# Altium project MB1361.PrjPcb (part 3 of 3)

## Sheet USB_Type_C.SchDoc: USB_Type_C
size A4; Date: Not used; ApprovedBy: Not used; CheckedBy: Not used; Author: Not used; CompanyName: STMicroelectronics; DrawnBy: Not used; Engineer: Not used; Organization: Not used; Address1: Not used; Address2: Not used; Address3: Not used; Address4: Not used; DocumentNumber: 7; Revision: Not used; SheetNumber: 7; SheetTotal: 9; CurrentTime: Not used; CurrentDate: Not used; Time: Not used; DocumentFullPathAndName: Not used; DocumentName: Not used; ModifiedDate: Not used; ImagePath: Not used; ProjectName: Not used; Application_BuildNumber: Not used
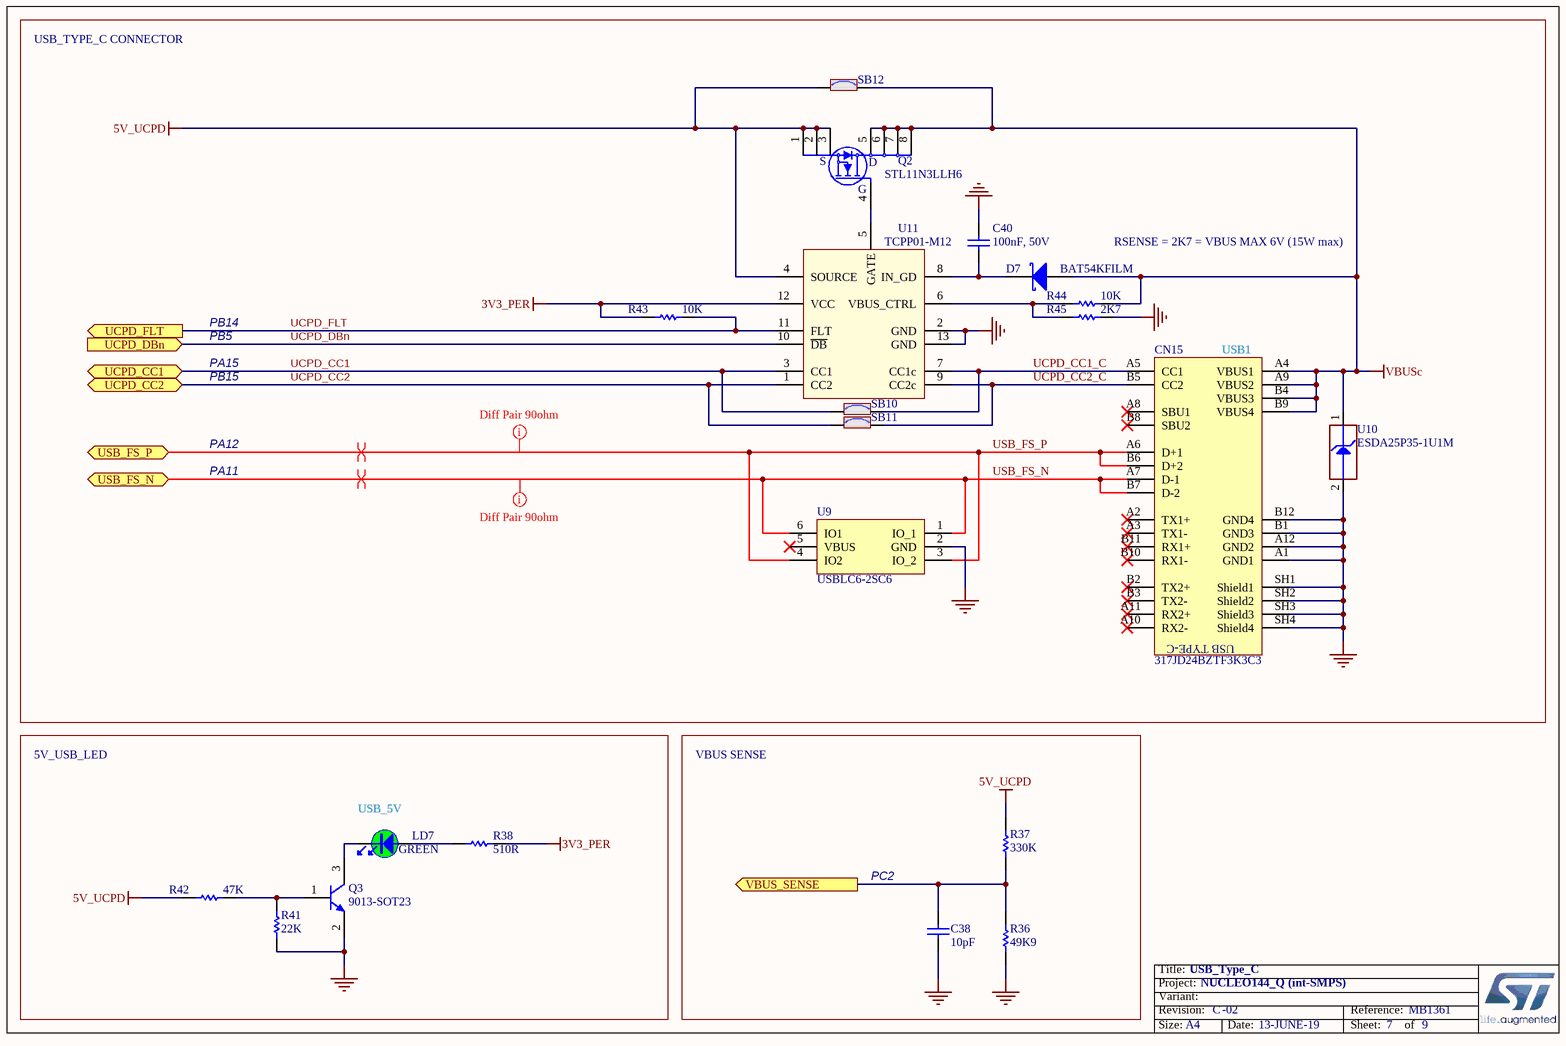
[diagram p7: USB_Type_C.SchDoc]

### Parts
C38  value 10pF  [C0603]
C40  value 100nF, 50V  [C0603]  (hidden comment: Capacitor)
CN15  value 317JD24BZTF3K3C3  [CON_USB-TYPEC_COXOC_317JD24BZTF3K3C3]  (hidden comment: USB_TYPE_C_Receptacle_317JD24BZTF3K3C3)
D7  value BAT54KFILM  [DIO_SOD523_1A_2K]  (hidden comment: SCHOTTKY_1A_2K)
LD7  value GREEN  [LED_0603_GREEN]
Q2  STL11N3LLH6  [MOS_POWERFLAT_3P3X3P3_P065]
Q3  value 9013-SOT23  [NPN_SOT23]
R36  value 49K9  [R0603]
R37  value 330K  [R0603]
R38  value 510R  [R0603]
R41  value 22K  [R0603]
R42  value 47K  [R0603]
R43  value 10K  [R0603]  (hidden comment: Resistor)
R44  value 10K  [R0603]  (hidden comment: Resistor)
R45  value 2K7  [R0603]  (hidden comment: Resistor)
SB10  (no value)  [SOLDER-BRIDGE_R0603-0R]
SB11  (no value)  [SOLDER-BRIDGE_R0603-0R]
SB12  (no value)  [SOLDER-BRIDGE_R0603-0R]
U9  USBLC6-2SC6  [ESD_SOT23-6L]
U10  value ESDA25P35-1U1M  [ESD_QFN1610_2N_1K_2A]  (hidden comment: ESD-TRANSIL)
U11  TCPP01-M12  [ICC_QFN12L-EPAD_3X3_P050]

### Ports
UCPD_CC1 (bidir), UCPD_CC2 (bidir), UCPD_DBn, UCPD_FLT, USB_FS_N (bidir), USB_FS_P (bidir), VBUS_SENSE

### Nets
3V3_PER: R38.1 R43.2 U11.12(VCC)
5V_UCPD: Q2.1(S) Q2.2(S) Q2.3(S) R37.2 R42.1 SB12.1 U11.4(SOURCE)
GND: C38.1 C40.1 CN15.A1(GND1) CN15.A12(GND2) CN15.B1(GND3) CN15.B12(GND4) CN15.SH1(Shield1) CN15.SH2(Shield2) CN15.SH3(Shield3) CN15.SH4(Shield4) Q3.2(E) R36.1 R41.1 R45.1 U9.2(GND) U10.2(GND) U11.2(GND) U11.13(GND)
VBUSc: CN15.A4(VBUS1) CN15.A9(VBUS2) CN15.B4(VBUS3) CN15.B9(VBUS4) D7.1(A) Q2.5(D) Q2.6(D) Q2.7(D) Q2.8(D) R44.2 SB12.2 U10.1(IO1)
UCPD_CC1: SB10.1 U11.3(CC1) ; port UCPD_CC1  [project net PA15]
UCPD_CC1_C: CN15.A5(CC1) SB10.2 U11.7(CC1c)
UCPD_CC2: SB11.1 U11.1(CC2) ; port UCPD_CC2  [project net PB15]
UCPD_CC2_C: CN15.B5(CC2) SB11.2 U11.9(CC2c)
UCPD_DBn: U11.10(~{DB}) ; port UCPD_DBn  [project net PB5]
UCPD_FLT: R43.1 U11.11(FLT) ; port UCPD_FLT  [project net PB14]
USB_FS_N: CN15.A7(D-1) CN15.B7(D-2) U9.1(IO_1) U9.6(IO1) ; port USB_FS_N
USB_FS_P: CN15.A6(D+1) CN15.B6(D+2) U9.3(IO_2) U9.4(IO2) ; port USB_FS_P
VBUS_SENSE: C38.2 R36.2 R37.1 ; port VBUS_SENSE
NetC40_2: C40.2 D7.2(K) U11.8(IN_GD)
NetLD7_1: LD7.1 R38.2
NetLD7_2: LD7.2 Q3.3(C)
NetQ2_4: Q2.4(G) U11.5(GATE)
NetQ3_1: Q3.1(B) R41.2 R42.2
NetR44_1: R44.1 R45.2 U11.6(VBUS_CTRL)

Not connected (* = marked no-connect by the designer): CN15 A2(TX1+)* A3(TX1-)* A8(SBU1)* A10(RX2-)* A11(RX2+)* B2(TX2+)* B3(TX2-)* B8(SBU2)* B10(RX1-)* B11(RX1+)*; U9 5(VBUS)*

### Layout directives
mark named Diff Pair 90ohm: USB_FS_N, USB_FS_P
differential pair: USB_FS_N, USB_FS_P

### Notes on the sheet
- USB_TYPE_C CONNECTOR
- RSENSE = 2K7 = VBUS MAX 6V (15W max)
- PA15
- PB15
- PB14
- PB5
- (near CN15) USB1
- PA12
- PA11
- 5V_USB_LED
- VBUS SENSE
- (near LD7) USB_5V
- PC2
- Title:
- Project:
- Size:
- Revision:
- Variant:
- A4
- -
- Date:
- Reference:
- Sheet:
- of
- (in symbol MCD-01108) USB TYPE-C

### Library data of the parts
C38 = MCD-00637: Capacitor, MLCC, 10pF, 50V, NPO, 5%, 0603, T=0,8mm; Manufacturer_Part_Number: CC0603JRNPO9BN100; Manufacturer: YAGEO; Provided_By: subcon; Initial_Board_Reference: MB1319; Internal_Part_Number: MCD-00637; Status: Released; Part_Type: Capacitor; Package: C0603; ComponentLink1Description: Datasheet; ComponentLink1URL: http://tunmcdsvn.tun.st.com/Component_Datasheet_Library/Trunk/Capacitors/Yageo_Capacitor_NP0_16V-to-50V; ECCN_US: n/a; ECCN_EU: n/a
C40 = MCD-01099: Capacitor,100nF,50V,X7R,10%,0603; Manufacturer_Part_Number: CC0603KRX7R9BB104; Manufacturer: YAGEO; Provided_By: SUBCO; Internal_Part_Number: MCD-01099; Status: Released; Part_Type: Capacitor; Package: C0603; ComponentLink1Description: Datasheet; ComponentLink1URL: http://tunmcdsvn.tun.st.com/Component_Datasheet_Library/Trunk/Capacitors/Yageo_Multilayer_Capacitor_X7R_series_100pF_to_22uF/Yageo_Mutilayer_Capacitor_X7R_100pF_to_22uF.pdf; ECCN_US: N/A; ECCN_EU: N/A
CN15 = MCD-01108: USB tyce C certified receptacle for 1.6mm pcb height; Part_Type: Connector; Manufacturer: CHANT SINCERE (COXOC); Provided_By: SUBCO; Internal_Part_Number: MCD-01108; Status: Released; Manufacturer_Part_Number: 317JD24BZTF3K3C3; ComponentLink1Description: Datasheet; ComponentLink1URL: http://tunmcdsvn.tun.st.com/Component_Datasheet_Library/Trunk/Connectors/Chant%20sincere_usb%20type%20C%20connector%20317JD24BZTF3K3C3; ECCN_US: n/a; ECCN_EU: n/a
D7 = MCD-01677: Small signal Schottky diodes; Part_Type: Diode; Manufacturer: STMICROELECTRONICS; ECCN_US: EAR99; ECCN_EU: NEC; Provided_By: SUBCO; Internal_Part_Number: MCD-01677; Status: Checked; Manufacturer_Part_Number: BAT54KFILM; Package: SOD-523; ComponentLink1Description: Datasheet; ComponentLink1URL: http://tunmcdsvn.tun.st.com/Component_Datasheet_Library/Trunk/Diodes/STM_SCHOTTKY_DOUBLE_BAT54SWFILM/STM_SCHOTTKY_DOUBLE_BAT54SWFILM.pdf
LD7 = MCD-00050: LED, Green, 0603; Part_Type: Display; Manufacturer_Part_Number: 19-213SYGC/S530-E2/TR8; Manufacturer: EVERLIGHT; ECCN_US: EAR99; ECCN_EU: NEC; Provided_By: Subcon; Initial_Board_Reference: MB1274; Internal_Part_Number: MCD-00050; Status: Released; ComponentLink1Description: Datasheet; Package: LED 0603; ComponentLink1URL: http://tunmcdsvn.tun.st.com/Component_Datasheet_Library/Trunk/Display/Everlight_SMD-LED-GREEN_19-213SYGC-S530-XX-TR8-v3.doc
Q2 = MCD-01810: N-channel 30 V, 6 mΩ typ, 11 A STripFET™ H6, Power MOSFET in a PowerFLAT™ 3.3x3.3 package; Part_Type: IC; Manufacturer: STMICROELECTRONICS; ECCN_US: EAR99; ECCN_EU: NEC; Provided_By: SUBCO with ST control; Internal_Part_Number: MCD-01810; Value: STL11N3LLH6; Status: Checked; Manufacturer_Part_Number: STL11N3LLH6; Package: PowerFLAT 3.3x3.3; ComponentLink1Description: Datasheet; ComponentLink1URL: http://tunmcdsvn.tun.st.com/Component_Datasheet_Library/Trunk/IC/STM_POWER_MOSFET_STL11N3LLH6
Q3 = MCD-00073: NPN Bipolar Transistor; Part_Type: IC; Manufacturer_Part_Number: BSR14; Manufacturer: NXP; ECCN_US: EAR99; ECCN_EU: NEC; Provided_By: Subcon; Initial_Board_Reference: MB1274; Revision: *; Internal_Part_Number: MCD-00073; Status: Released; ComponentLink1Description: Datasheet; ComponentLink1URL: http://tunmcdsvn.tun.st.com/Component_Datasheet_Library/Trunk/IC/NXP_Transistor_BSR14
R36 = MCD-01171: Resistor,49K9,0603,1%; Manufacturer_Part_Number: RC0603FR-0749K9L; Manufacturer: YAGEO; Provided_By: Subcon; Initial_Board_Reference: MB1397; Internal_Part_Number: MCD-01171; Status: Released; Part_Type: Resistor; Package: R0603; ComponentLink1Description: Datasheet; ComponentLink1URL: http://tunmcdsvn.tun.st.com/Component_Datasheet_Library/Trunk/Resistors/Yageo_Resistor_RC0603-series/; ECCN_US: n/a; ECCN_EU: n/a
R37 = MCD-00458: Resistor,330K,0603,1%,1/10W; Manufacturer_Part_Number: RC0603FR-07330KL; Manufacturer: YAGEO; Provided_By: Subcon; Internal_Part_Number: MCD-00458; Status: Released; Part_Type: Resistor; Package: R0603; ComponentLink1Description: Datasheet; ComponentLink1URL: http://tunmcdsvn.tun.st.com/Component_Datasheet_Library/Trunk/Resistors/Yageo_Resistor_RC0603-series; ECCN_US: n/a; ECCN_EU: n/a
R38 = MCD-00225: Resistor,510R,0603,1%,1/10W; Manufacturer_Part_Number: RC0603FR-07510RL; Manufacturer: YAGEO; Provided_By: Subcon; Initial_Board_Reference: MB1319; Internal_Part_Number: MCD-00225; Status: Released; Part_Type: Resistor; ComponentLink1Description: Datasheet; ECCN_US: n/a; ECCN_EU: n/a; Package: R0603; ComponentLink1URL: http://tunmcdsvn.tun.st.com/Component_Datasheet_Library/Trunk/Resistors/Yageo_Resistor_RC0603-series
R41 = MCD-00430: Resistor,22K,0603,1%,1/10W; Manufacturer_Part_Number: RC0603FR-0722KL; Manufacturer: YAGEO; Provided_By: Subcon; Internal_Part_Number: MCD-00430; Status: Released; Part_Type: Resistor; ComponentLink1Description: Datasheet; ECCN_US: n/a; ECCN_EU: n/a; Package: R0603; ComponentLink1URL: http://tunmcdsvn.tun.st.com/Component_Datasheet_Library/Trunk/Resistors/Yageo_Resistor_RC0603-series
R42 = MCD-00222: Resistor,47K,0603,1%,1/10W; Manufacturer_Part_Number: RC0603FR-0747KL; Manufacturer: YAGEO; Provided_By: Subcon; Initial_Board_Reference: MB1319; Internal_Part_Number: MCD-00222; Status: Released; Part_Type: Resistor; ComponentLink1Description: Datasheet; ECCN_US: n/a; ECCN_EU: n/a; Package: R0603; ComponentLink1URL: http://tunmcdsvn.tun.st.com/Component_Datasheet_Library/Trunk/Resistors/Yageo_Resistor_RC0603-series
R43 R44 = MCD-00220: Resistor,10K,0603,1%,1/10W; Manufacturer_Part_Number: RC0603FR-0710KL; Manufacturer: YAGEO; ECCN_US: EAR99; ECCN_EU: NEC; Provided_By: SUBCO; Internal_Part_Number: MCD-00220; Status: Released; Part_Type: Resistor; Package: R0603; ComponentLink1Description: Datasheet; ComponentLink1URL: http://tunmcdsvn.tun.st.com/Component_Datasheet_Library/Trunk/Resistors/Yageo_Resistor_RC0603-series
R45 = MCD-00218: Resistor,2K7,0603,1%,1/10W; Manufacturer_Part_Number: RC0603FR-072K7L; Manufacturer: YAGEO; BMS_Part_Number: 9129767; ECCN_US: EAR99; ECCN_EU: NEC; Provided_By: SUBCO; Internal_Part_Number: MCD-00218; Status: Released; Part_Type: Resistor; Package: R0603; ComponentLink1Description: Datasheet; ComponentLink1URL: http://tunmcdsvn.tun.st.com/Component_Datasheet_Library/Trunk/Resistors/Yageo_Resistor_RC0603-series
SB10-SB12 = MCD-00071: as SB111-SB113 on sheet ARDUINO_extension_connectors; Internal_Part_Number: MCD-00071; Status: Released; ECCN_US: n/a; ECCN_EU: n/a; ComponentLink1Description: Datasheet
U9 = MCD-00163: Very low capacitance ESD protection; Part_Type: IC; Manufacturer: STMICROELECTRONICS; BMS_Part_Number: 9151075; ECCN_US: EAR99; ECCN_EU: NEC; Provided_By: SUBCO with ST control; Internal_Part_Number: MCD-00163; Value: USBLC6-2SC6; Status: Released; Manufacturer_Part_Number: USBLC6-2SC6; ComponentLink1Description: Datasheet; ComponentLink1URL: http://tunmcdsvn.tun.st.com/Component_Datasheet_Library/Trunk/Diodes/STM_ESD_USBLC6-2
U10 = MCD-01207: High power Transient voltage suppressor:25V/35A EOS and ESD transients protection.; Part_Type: Diode; Manufacturer: STMICROELECTRONICS; BMS_Part_Number: 9179045; ECCN_US: EAR99; ECCN_EU: NEC; Provided_By: SUBCO with ST control; Internal_Part_Number: MCD-01207; Status: Checked; Manufacturer_Part_Number: ESDA25P35-1U1M; Package: QFN1610; ComponentLink1Description: Datasheet; ComponentLink1URL: http://tunmcdsvn.tun.st.com/Component_Datasheet_Library/Trunk/Diodes/STM_ESD_ESDA25P35-1U1M
U11 = MCD-01809: USB Type-C Port Protection for USB Power Delivery, PPS compliant; Part_Type: IC; Manufacturer: STMICROELECTRONICS; ECCN_US: EAR99; ECCN_EU: NEC; Provided_By: SUBCO with ST control; Internal_Part_Number: MCD-01809; Value: TCPP01-M12; Status: Checked; Manufacturer_Part_Number: TCPP01-M12; Package: QFN-12L; ComponentLink1Description: Datasheet; ComponentLink1URL: http://tunmcdsvn.tun.st.com/Component_Datasheet_Library/Trunk/IC/STM_UCPD_Protection_TCPP01-M12

## Sheet POWER_BOARD.SchDoc: POWER_BOARD
size A4; Date: Not used; ApprovedBy: Not used; CheckedBy: Not used; Author: Not used; CompanyName: STMicroelectronics; DrawnBy: Not used; Engineer: Not used; Organization: Not used; Address1: Not used; Address2: Not used; Address3: Not used; Address4: Not used; DocumentNumber: 6; Revision: Not used; SheetNumber: 6; SheetTotal: 9; CurrentTime: Not used; CurrentDate: Not used; Time: Not used; DocumentFullPathAndName: Not used; DocumentName: Not used; ModifiedDate: Not used; ImagePath: Not used; ProjectName: Not used; Application_BuildNumber: Not used
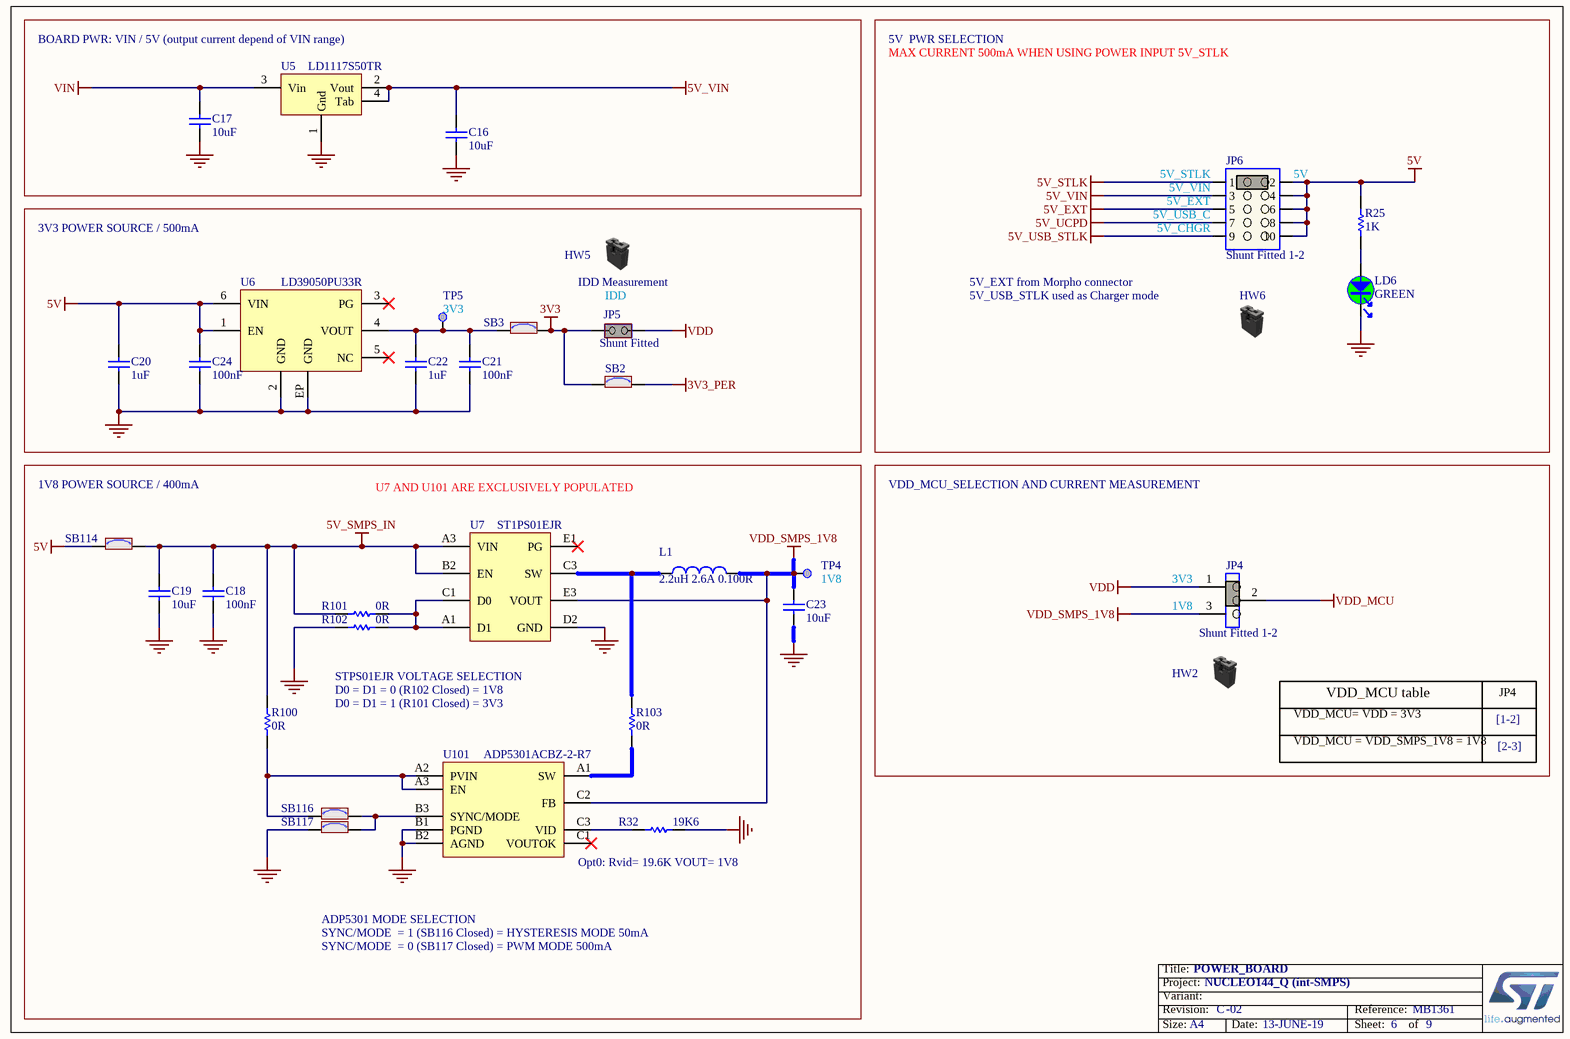
[diagram p8: POWER_BOARD.SchDoc]

### Parts
C16  value 10uF  [C0805]
C17  value 10uF  [C0805]
C18  value 100nF  [C0603]
C19  value 10uF  [C0603]
C20  value 1uF  [C0603]  (hidden comment: Capacitor)
C21  value 100nF  [C0603]
C22  value 1uF  [C0603]  (hidden comment: Capacitor)
C23  value 10uF  [C0603]
C24  value 100nF  [C0603]
HW2  (no value)  (mechanical)
HW5  (no value)  (mechanical)
HW6  (no value)  (mechanical)
JP4  value Shunt Fitted 1-2  [CON_SAMTEC_TSW-103-07-F-S]
JP5  value Shunt Fitted  [CON_SAMTEC_TSW-102-07-G-S]
JP6  value Shunt Fitted 1-2  [CON_SAMTEC_TSW-105-07-X-D]
L1  value 2.2uH 2.6A 0.100R  [IND_TDK_VLS252010HBX-1]
LD6  value GREEN  [LED_0603_GREEN]
R25  value 1K  [R0603]
R32  value 19K6  [R0603]
R100  value 0R  [R0603]
R101  value 0R  [R0603]
R102  value 0R  [R0603]
R103  value 0R  [R0603]
SB2  (no value)  [SOLDER-BRIDGE_R0603-0R]
SB3  (no value)  [SOLDER-BRIDGE_R0603-0R]
SB114  (no value)  [SOLDER-BRIDGE_R0603-0R]
SB116  (no value)  [SOLDER-BRIDGE_R0603-0R]
SB117  (no value)  [SOLDER-BRIDGE_R0603-0R]
TP4  (no value)  [TP_SMD_1MM]  (no BOM)
TP5  (no value)  [TP_SMD_1MM]  (no BOM)
U5  value LD1117S50TR  [REG_SOT223-TAB]
U6  value LD39050PU33R  [ICC_DFN6-EPAD_3X3_P095]
U7  value ST1PS01EJR  [ICC_FLIP-CHIP-BGA8_1P11X1P41_P040]
U101  value ADP5301ACBZ-2-R7  [ICC_WLCSP9_1P65X1P87_P050]

### Blocks framed on the sheet
BOARD PWR: VIN / 5V (output current depend of VIN range): C16 C17 U5
VDD_MCU table: HW2 JP4

### Nets
3V3: JP5.1(COMMON) SB2.1 SB3.2
3V3_PER: SB2.2
5V: C20.2 C24.2 JP6.2 JP6.4 JP6.6 JP6.8 JP6.10 R25.2 SB114.1 U6.1(EN) U6.6(VIN)
5V_EXT: JP6.5
5V_SMPS_IN: C18.2 C19.2 R100.1 R101.2 SB114.2 U7.A3(VIN) U7.B2(EN)
5V_STLK: JP6.1
5V_UCPD: JP6.7
5V_USB_STLK: JP6.9
5V_VIN: C16.2 JP6.3 U5.2(Vout) U5.4(Tab)
GND: C16.1 C17.1 C18.1 C19.1 C20.1 C21.1 C22.1 C23.1 C24.1 LD6.2 R32.2 R102.2 SB117.1 U5.1(Gnd) U6.2(GND) U6.EP(GND) U7.D2(GND) U101.B1(PGND) U101.B2(AGND)
VDD: JP4.1 JP5.2(NO)
VDD_MCU: JP4.2
VDD_SMPS_1V8: C23.2 JP4.3 L1.2 TP4.1 U7.E3(VOUT) U101.C2(FB)
VIN: C17.2 U5.3(Vin)
NetC21_2: C21.2 C22.2 SB3.1 TP5.1 U6.4(VOUT)
NetL1_1: L1.1 R103.1 U7.C3(SW)
NetLD6_1: LD6.1 R25.1
NetR32_1: R32.1 U101.C3(VID)
NetR100_2: R100.2 SB116.1 U101.A2(PVIN) U101.A3(EN)
NetR101_1: R101.1 R102.1 U7.A1(D1) U7.C1(D0)
NetR103_2: R103.2 U101.A1(SW)
NetSB116_2: SB116.2 SB117.2 U101.B3(SYNC/MODE)

Not connected (* = marked no-connect by the designer): U6 3(PG)* 5(NC)*; U7 E1(PG)*; U101 C1(VOUTOK)*

### Notes on the sheet
- 5V  PWR SELECTION
- MAX CURRENT 500mA WHEN USING POWER INPUT 5V_STLK
- (near JP6) 5V_STLK
- (near JP6) 5V
- 3V3 POWER SOURCE / 500mA
- (near JP6) 5V_CHGR
- (near JP6) 5V_VIN
- (near JP6) 5V_EXT
- (near JP6) 5V_USB_C
- (near TP5) 3V3
- IDD Measurement
- (near JP5) IDD
- 5V_EXT from Morpho connector
- 5V_USB_STLK used as Charger mode
- 1V8 POWER SOURCE / 400mA
- U7 AND U101 ARE EXCLUSIVELY POPULATED
- VDD_MCU_SELECTION AND CURRENT MEASUREMENT
- (near TP4) 1V8
- (near JP4) 3V3
- 1V8
- STPS01EJR VOLTAGE SELECTION
  D0 = D1 = 0 (R102 Closed) = 1V8
  D0 = D1 = 1 (R101 Closed) = 3V3
- VDD_MCU= VDD = 3V3
- [1-2]
- JP4
- VDD_MCU = VDD_SMPS_1V8 = 1V8
- [2-3]
- Opt0: Rvid= 19.6K VOUT= 1V8
- ADP5301 MODE SELECTION
  SYNC/MODE  = 1 (SB116 Closed) = HYSTERESIS MODE 50mA
  SYNC/MODE  = 0 (SB117 Closed) = PWM MODE 500mA
- Title:
- Project:
- Size:
- Revision:
- Variant:
- A4
- -
- Date:
- Reference:
- Sheet:
- of

### Library data of the parts
C16 C17 = MCD-00014: Capacitor, MLCC, 10uF, 25V, X5R, 10%, 0805, T=0,85mm; Manufacturer_Part_Number: CC0805KRX5R8BB106; Manufacturer: YAGEO; Provided_By: Subcon; Initial_Board_Reference: MB1274; Internal_Part_Number: MCD-00014; ECCN_US: n/a; ECCN_EU: n/a; ComponentLink1Description: Datasheet; Status: Released; Part_Type: Capacitor; Package: C0805; ComponentLink1URL: http://tunmcdsvn.tun.st.com/Component_Datasheet_Library/Trunk/Capacitors/Yageo_Multilayer_capacitor_X5R_series_100pF_to_100uF
C18 C21 C24 = MCD-00211: Capacitor, MLCC, 100nF, 16V, X7R, 10%, 0603, T=0,8mm; Manufacturer_Part_Number: CC0603KRX7R7BB104; Manufacturer: YAGEO; Provided_By: Subcon; Initial_Board_Reference: MB1319; Internal_Part_Number: MCD-00211; ECCN_US: n/a; ECCN_EU: n/a; ComponentLink1Description: Datasheet; Status: Released; Part_Type: Capacitor; Package: C0603; ComponentLink1URL: http://tunmcdsvn.tun.st.com/Component_Datasheet_Library/Trunk/Capacitors/Yageo_Multilayer_Capacitor_X7R_series_100pF_to_22uF
C19 C23 = MCD-00243: Capacitor, MLCC, 10uF, 6V3, X5R, 10%, 0603, T=0,8mm; Manufacturer_Part_Number: CC0603KRX5R5BB106; Manufacturer: YAGEO; Provided_By: Subcon; Initial_Board_Reference: MB1319; Internal_Part_Number: MCD-00243; ECCN_US: n/a; ECCN_EU: n/a; ComponentLink1Description: Datasheet; Status: Released; Part_Type: Capacitor; Package: C0603; ComponentLink1URL: http://tunmcdsvn.tun.st.com/Component_Datasheet_Library/Trunk/Capacitors/Yageo_Multilayer_capacitor_X5R_series_100pF_to_100uF
C20 C22 = MCD-00010: Capacitor, MLCC, 1uF, 16V, X5R, 10%, 0603, T=0,8mm; Manufacturer_Part_Number: CC0603KRX5R7BB105; Manufacturer: YAGEO; Provided_By: SUBCO; Internal_Part_Number: MCD-00010; Status: Released; Part_Type: Capacitor; Package: C0603; ComponentLink1Description: Datasheet; ComponentLink1URL: http://tunmcdsvn.tun.st.com/Component_Datasheet_Library/Trunk/Capacitors/Yageo_Multilayer_capacitor_X5R_series_100pF_to_100uF
HW2 HW5 HW6 = MCD-00043: SHUNT 2.54mm BLACK; Manufacturer_Part_Number: SNT-100-BK-G; Manufacturer: SAMTEC; Part_Type: Mechanical; Provided_By: Subcon; Initial_Board_Reference: MB1274; Internal_Part_Number: MCD-00043; ECCN_US: n/a; ECCN_EU: n/a; ComponentLink1Description: Datasheet; Status: Released; ComponentLink1URL: http://tunmcdsvn.tun.st.com/Component_Datasheet_Library/Trunk/Connectors/Samtec_Shunt_Jumper_SNT100
JP4 = MCD-00684: Header, 3x1, 2,54mm, VR, TH, Height 5.84mm/2.54mm - Shunt Fitted 1-2 by default; Part_Type: Connector; Manufacturer_Part_Number: TSW-103-07-F-S; Manufacturer: SAMTEC; Provided_By: Subcon; Initial_Board_Reference: MB1331; Internal_Part_Number: MCD-00684; Status: Released; ComponentLink1Description: Datasheet; ComponentLink1URL: http://tunmcdsvn.tun.st.com/Component_Datasheet_Library/Trunk/Connectors/Samtec_TSW-HTSW-series; ECCN_US: n/a; ECCN_EU: n/a; Remark: Shunt Fitted 1-2
JP5 = MCD-00683: Header, 2x1, 2,54mm, VR, TH, Height 5.84mm/2.54mm - Shunt Fitted by default; Part_Type: Connector; Manufacturer_Part_Number: TSW-102-07-x-S; Manufacturer: SAMTEC; Provided_By: Subcon; Initial_Board_Reference: MB1331; Internal_Part_Number: MCD-00683; Status: Released; ComponentLink1Description: Datasheet; ComponentLink1URL: http://tunmcdsvn.tun.st.com/Component_Datasheet_Library/Trunk/Connectors/Samtec_TSW-HTSW-series; ECCN_US: n/a; ECCN_EU: n/a; Remark: Shunt Fitted
JP6 = MCD-01203: Header, 5x2, 2,54mm, VR, TH, Height 5.84mm/2.54mm - Shunt Fitted 1-2; Part_Type: Connector; Manufacturer_Part_Number: TSW-105-07-x-D; Manufacturer: SAMTEC; Provided_By: Subcon; Initial_Board_Reference: Mb1372; Internal_Part_Number: MCD-01203; Status: Checked; ComponentLink1Description: Datasheet; ComponentLink1URL: http://tunmcdsvn.tun.st.com/Component_Datasheet_Library/Trunk/Connectors/Samtec_TSW-HTSW-series; ECCN_US: n/a; ECCN_EU: n/a
L1 = MCD-00240: FIXED IND 2.2UH 2.6A 100 mOHM 20% SMD; Manufacturer_Part_Number: VLS252010HBX-2R2M-1; Manufacturer: TDK; Provided_By: Subcon; Initial_Board_Reference: MB1319; Internal_Part_Number: MCD-00240; ECCN_US: n/a; ECCN_EU: n/a; ComponentLink1Description: Datasheet; Status: Released; Part_Type: Inductor; ComponentLink1URL: http://tunmcdsvn.tun.st.com/Component_Datasheet_Library/Trunk/Inductors/TDK_Inductor_VLS252010HBX-1
LD6 = MCD-00050: LED, Green, 0603; Manufacturer_Part_Number: 19-213SYGC/S530-E2/TR8; Manufacturer: EVERLIGHT; Part_Type: Display; ECCN_US: EAR99; ECCN_EU: NEC; Provided_By: Subcon; Initial_Board_Reference: MB1274; Internal_Part_Number: MCD-00050; ComponentLink1Description: Datasheet; Status: Released; Package: LED 0603; ComponentLink1URL: http://tunmcdsvn.tun.st.com/Component_Datasheet_Library/Trunk/Display/Everlight_SMD-LED-GREEN_19-213SYGC-S530-XX-TR8-v3.doc
R25 = MCD-00070: Resistor,1K,0603,1%,1/10W; Manufacturer_Part_Number: RC0603FR-071KL; Manufacturer: YAGEO; Provided_By: Subcon; Initial_Board_Reference: MB1274; Internal_Part_Number: MCD-00070; Status: Released; Part_Type: Resistor; Package: R0603; ComponentLink1Description: Datasheet; ComponentLink1URL: http://tunmcdsvn.tun.st.com/Component_Datasheet_Library/Trunk/Resistors/Yageo_Resistor_RC0603-series; ECCN_US: n/a; ECCN_EU: n/a
R32 = MCD-00242: Resistor,19K6,0603,1%,1/10W; Manufacturer_Part_Number: RC0603FR-0719K6L; Manufacturer: YAGEO; Provided_By: Subcon; Initial_Board_Reference: MB1319; Internal_Part_Number: MCD-00242; ECCN_US: n/a; ECCN_EU: n/a; ComponentLink1Description: Datasheet; Status: Released; Part_Type: Resistor; Package: R0603; ComponentLink1URL: http://tunmcdsvn.tun.st.com/Component_Datasheet_Library/Trunk/Resistors/Yageo_Resistor_RC0603-series
R100-R103 = MCD-00056: Resistor,0R,0603,5%,1/10W; Manufacturer_Part_Number: RC0603JR-070RL; Manufacturer: YAGEO; Provided_By: subcon; Initial_Board_Reference: MB1274; Internal_Part_Number: MCD-00056; ECCN_US: n/a; ECCN_EU: n/a; ComponentLink1Description: Datasheet; Status: Released; Part_Type: Resistor; Package: R0603; ComponentLink1URL: http://tunmcdsvn.tun.st.com/Component_Datasheet_Library/Trunk/Resistors/Yageo_Resistor_RC0603-series
SB2 SB3 SB114 SB116 SB117 = MCD-00071: as SB111-SB113 on sheet ARDUINO_extension_connectors; Internal_Part_Number: MCD-00071; ECCN_US: n/a; ECCN_EU: n/a; Status: Released; ComponentLink1Description: Datasheet
TP4 TP5 = MCD-00074: Test Point 1mm; Part_Type: Mechanical; Initial_Board_Reference: MB1274; Internal_Part_Number: MCD-00074; Value: 1mm; Status: Released; Manufacturer_Part_Number: n/a; Manufacturer: n/a; ComponentLink1Description: Datasheet; ComponentLink1URL: http://na; ECCN_US: n/a; ECCN_EU: n/a; Provided_By: n/a
U5 = MCD-00088: IC REG LDO 5V 0.8A SOT223; Manufacturer: STMICROELECTRONICS; ECCN_US: EAR99; ECCN_EU: NEC; Provided_By: Subcon; Initial_Board_Reference: MB1274; Internal_Part_Number: MCD-00088; Manufacturer_Part_Number: LD1117S50TR; ComponentLink1Description: Datasheet; Status: Released; Part_Type: IC; ComponentLink1URL: http://tunmcdsvn.tun.st.com/Component_Datasheet_Library/Trunk/IC/STM_LDO_LD1117; Package: SOT-223
U6 = MCD-00215: Low quiescent current and low noise voltage regulators; Manufacturer: STMICROELECTRONICS; Part_Type: IC; ECCN_US: EAR99; ECCN_EU: NEC; Provided_By: Subcon; Initial_Board_Reference: MB1319; Internal_Part_Number: MCD-00215; Manufacturer_Part_Number: LD39050PU33R; Status: Released; ComponentLink1Description: Datasheet; ComponentLink1URL: http://tunmcdsvn.tun.st.com/Component_Datasheet_Library/Trunk/IC/STM_LDO_LD39050PU; Package: DFN6 3x3mm
U7 = MCD-00228: 400mA Nano-Quiescent Step down converter; Manufacturer: STMICROELECTRONICS; Part_Type: IC; ECCN_US: EAR99; ECCN_EU: NEC; Provided_By: Subcon; Initial_Board_Reference: MB1319; Internal_Part_Number: MCD-00228; Manufacturer_Part_Number: ST1PS01EJR; ComponentLink1Description: Datasheet; Status: Checked; ComponentLink1URL: http://tunmcdsvn.tun.st.com/Component_Datasheet_Library/Trunk/IC/STM_SMPS_ST1PS01_rel1.31
U101 = MCD-00226: UL Step down regulator: Opt0; Manufacturer: ANALOG DEVICES; Part_Type: IC; ECCN_US: EAR99; ECCN_EU: NEC; Provided_By: Subcon; Initial_Board_Reference: MB1319; Internal_Part_Number: MCD-00226; Manufacturer_Part_Number: ADP5301ACBZ-2-R7; ComponentLink1Description: Datasheet; Status: Released; ComponentLink1URL: http://tunmcdsvn.tun.st.com/Component_Datasheet_Library/Trunk/IC/AD_SMPS_ADP5301

## Nets that join several sheets
3V3: ARDUINO_extension_connectors (CN8.7 CN11.16 SB113.1), POWER_BOARD (JP5.1 SB2.1 SB3.2)
3V3_PER: STM32_microcontroller_IOs (R28.1 R29.1), ST_LINK_V2-1 (R21.1 SB110.2), ARDUINO_extension_connectors (R30.2 SB111.1), USB_Type_C (R38.1 R43.2 U11.12), POWER_BOARD (SB2.2)
5V: ST_LINK_V2-1 (D2.1), ARDUINO_extension_connectors (CN8.9 CN11.18), POWER_BOARD (11 pins)
5V_EXT: ST_LINK_V2-1 (D4.1), ARDUINO_extension_connectors (CN11.6), POWER_BOARD (JP6.5)
5V_STLK: ST_LINK_V2-1 (C11.2 TP3.1 U4.1), ARDUINO_extension_connectors (CN12.8), POWER_BOARD (JP6.1)
5V_UCPD: ST_LINK_V2-1 (D3.1), USB_Type_C (7 pins), POWER_BOARD (JP6.7)
5V_USB_STLK: ST_LINK_V2-1 (9 pins), POWER_BOARD (JP6.9)
5V_VIN: ST_LINK_V2-1 (D5.1), ARDUINO_extension_connectors (R31.2), POWER_BOARD (C16.2 JP6.3 U5.2 U5.4)
AGND: STM32_microcontroller_power (6 pins), ARDUINO_extension_connectors (C102.1 CN10.3 CN12.32)
GND: STM32_microcontroller_IOs (18 pins), STM32_microcontroller_power (35 pins), ST_LINK_V2-1 (50 pins), ARDUINO_extension_connectors (26 pins), USB_Type_C (18 pins), POWER_BOARD (19 pins)
VBAT: STM32_microcontroller_power (C114.2 SB146.2 U8.6), ARDUINO_extension_connectors (CN11.33)
VDD: STM32_microcontroller_power (SB132.1 SB133.1 SB149.1), ARDUINO_extension_connectors (CN11.5), POWER_BOARD (JP4.1 JP5.2)
VDD_MCU: STM32_microcontroller_IOs (B1.1 B1.2), STM32_microcontroller_power (22 pins), ST_LINK_V2-1 (SB109.2), ARDUINO_extension_connectors (SB112.1), POWER_BOARD (JP4.2)
VDDA: STM32_microcontroller_power (6 pins), ARDUINO_extension_connectors (CN10.1)
VIN: ARDUINO_extension_connectors (CN8.15 CN11.24), POWER_BOARD (C17.2 U5.3)
VREFP: STM32_microcontroller_power (C31.1 C32.2 SB5.2 U8.31), ARDUINO_extension_connectors (C102.2 SB115.2)
ARD_D0_RX: STM32_microcontroller_IOs (SB125.2 SB130.1), ARDUINO_extension_connectors (CN10.16)
ARD_D1_TX: STM32_microcontroller_IOs (SB123.2 SB128.1), ARDUINO_extension_connectors (CN10.14)
MCO: STM32_microcontroller_IOs (SB143.2), ST_LINK_V2-1 (C8.1 R19.2)
NRST: STM32_microcontroller_IOs (5 pins), ST_LINK_V2-1 (JP3.2), ARDUINO_extension_connectors (CN8.5 CN11.14)
PA0: STM32_microcontroller_IOs (SB155.2 U8.33), ARDUINO_extension_connectors (CN11.28 SB156.1)
PA1: STM32_microcontroller_IOs (U8.34), ARDUINO_extension_connectors (CN10.11 CN11.30)
PA2: STM32_microcontroller_IOs (U8.35), ARDUINO_extension_connectors (CN12.35 SB152.1 SB153.1)
PA3: STM32_microcontroller_IOs (U8.36), ARDUINO_extension_connectors (CN9.1 CN12.37)
PA4: STM32_microcontroller_IOs (U8.39), ARDUINO_extension_connectors (CN11.32 SB121.1 SB136.1)
PA5: STM32_microcontroller_IOs (U8.40), ARDUINO_extension_connectors (CN7.10 CN12.11 SB120.1)
PA6: STM32_microcontroller_IOs (U8.41), ARDUINO_extension_connectors (CN7.12 CN12.13)
PA7: STM32_microcontroller_IOs (U8.42), ARDUINO_extension_connectors (CN7.14 CN12.15)
PA8: STM32_microcontroller_IOs (U8.100), ARDUINO_extension_connectors (CN10.31 CN12.23)
PA9: STM32_microcontroller_IOs (R105.1 U8.101), ARDUINO_extension_connectors (CN12.21)
PA10: STM32_microcontroller_IOs (U8.102), ARDUINO_extension_connectors (CN12.33)
PA11: STM32_microcontroller_IOs (SB137.1), ARDUINO_extension_connectors (CN12.14)
PA12: STM32_microcontroller_IOs (SB138.1), ARDUINO_extension_connectors (CN12.12)
PA13: STM32_microcontroller_IOs (U8.105), ST_LINK_V2-1 (SB107.1), ARDUINO_extension_connectors (CN11.13)
PA14: STM32_microcontroller_IOs (U8.109), ST_LINK_V2-1 (SB103.1), ARDUINO_extension_connectors (CN11.15)
PA15: STM32_microcontroller_IOs (U8.110), ARDUINO_extension_connectors (CN11.17), USB_Type_C (SB10.1 U11.3)
PB0: STM32_microcontroller_IOs (U8.43), ARDUINO_extension_connectors (SB160.1 SB161.1 SB162.2)
PB1: STM32_microcontroller_IOs (U8.44), ARDUINO_extension_connectors (CN10.7 CN12.24)
PB2: STM32_microcontroller_IOs (U8.45), ARDUINO_extension_connectors (CN9.13 CN12.22)
PB3: STM32_microcontroller_IOs (SB140.2 U8.132), ARDUINO_extension_connectors (CN7.15 CN12.31)
PB4: STM32_microcontroller_IOs (U8.133), ARDUINO_extension_connectors (CN12.27 SB134.1 SB139.1)
PB5: STM32_microcontroller_IOs (U8.134), ARDUINO_extension_connectors (CN12.29 SB135.1), USB_Type_C (U11.10)
PB6: STM32_microcontroller_IOs (U8.135), ARDUINO_extension_connectors (CN9.15 CN12.17)
PB7: STM32_microcontroller_IOs (R107.1 U8.136), ARDUINO_extension_connectors (CN11.21)
PB8: STM32_microcontroller_IOs (U8.138), ARDUINO_extension_connectors (CN7.2 CN12.3)
PB9: STM32_microcontroller_IOs (U8.139), ARDUINO_extension_connectors (CN7.4 CN12.5)
PB10: STM32_microcontroller_IOs (U8.66), ARDUINO_extension_connectors (CN12.25 SB151.1 SB157.2)
PB11: STM32_microcontroller_IOs (U8.67), ARDUINO_extension_connectors (CN10.34 CN12.18)
PB13: STM32_microcontroller_IOs (U8.74), ARDUINO_extension_connectors (CN7.5 CN12.30)
PB14: STM32_microcontroller_IOs (U8.75), ARDUINO_extension_connectors (CN12.28), USB_Type_C (R43.1 U11.11)
PB15: STM32_microcontroller_IOs (U8.76), ARDUINO_extension_connectors (CN12.26), USB_Type_C (SB11.1 U11.1)
PC0: STM32_microcontroller_IOs (U8.26), ARDUINO_extension_connectors (CN9.11 CN11.38)
PC1: STM32_microcontroller_IOs (U8.27), ARDUINO_extension_connectors (CN9.9 CN11.36)
PC2: STM32_microcontroller_IOs (SB8.1 U8.28), ARDUINO_extension_connectors (CN11.35 SB144.1)
PC3: STM32_microcontroller_IOs (U8.29), ARDUINO_extension_connectors (CN9.5 CN11.37)
PC6: STM32_microcontroller_IOs (U8.96), ARDUINO_extension_connectors (CN7.1 CN12.4)
PC7: STM32_microcontroller_IOs (U8.97), ARDUINO_extension_connectors (CN12.19 SB118.1)
PC8: STM32_microcontroller_IOs (U8.98), ARDUINO_extension_connectors (CN8.2 SB119.2)
PC9: STM32_microcontroller_IOs (U8.99), ARDUINO_extension_connectors (CN8.4 SB122.1)
PC10: STM32_microcontroller_IOs (U8.111), ARDUINO_extension_connectors (CN8.6 CN11.1)
PC11: STM32_microcontroller_IOs (U8.112), ARDUINO_extension_connectors (CN8.8 CN11.2)
PC12: STM32_microcontroller_IOs (U8.113), ARDUINO_extension_connectors (CN8.10 CN11.3)
PC13: STM32_microcontroller_IOs (SB154.2 U8.7), ARDUINO_extension_connectors (CN11.23)
PC14: STM32_microcontroller_IOs (SB148.2), ARDUINO_extension_connectors (CN11.25)
PC15: STM32_microcontroller_IOs (SB147.2), ARDUINO_extension_connectors (CN11.27)
PD0: STM32_microcontroller_IOs (U8.114), ARDUINO_extension_connectors (CN9.25 CN11.57)
PD1: STM32_microcontroller_IOs (U8.115), ARDUINO_extension_connectors (CN9.27 CN11.55)
PD2: STM32_microcontroller_IOs (U8.116), ARDUINO_extension_connectors (CN8.12 CN11.4)
PD3: STM32_microcontroller_IOs (U8.117), ARDUINO_extension_connectors (CN9.10 CN11.40)
PD4: STM32_microcontroller_IOs (U8.118), ARDUINO_extension_connectors (CN9.8 CN11.39)
PD5: STM32_microcontroller_IOs (U8.119), ARDUINO_extension_connectors (CN9.6 CN11.41)
PD6: STM32_microcontroller_IOs (U8.122), ARDUINO_extension_connectors (CN9.4 CN11.43)
PD7: STM32_microcontroller_IOs (U8.123), ARDUINO_extension_connectors (CN9.2 CN11.45)
PD8: STM32_microcontroller_IOs (SB123.1 SB124.1 U8.77), ARDUINO_extension_connectors (CN12.10)
PD9: STM32_microcontroller_IOs (SB125.1 SB126.1 U8.78), ARDUINO_extension_connectors (CN11.69)
PD10: STM32_microcontroller_IOs (U8.79), ARDUINO_extension_connectors (CN12.65)
PD11: STM32_microcontroller_IOs (U8.80), ARDUINO_extension_connectors (CN7.3 CN12.45)
PD12: STM32_microcontroller_IOs (U8.81), ARDUINO_extension_connectors (CN7.7 CN12.43)
PD13: STM32_microcontroller_IOs (U8.82), ARDUINO_extension_connectors (CN12.41)
PD14: STM32_microcontroller_IOs (U8.85), ARDUINO_extension_connectors (CN7.16 CN12.46)
PD15: STM32_microcontroller_IOs (U8.86), ARDUINO_extension_connectors (CN7.18 CN12.48)
PE0: STM32_microcontroller_IOs (U8.140), ARDUINO_extension_connectors (CN10.33 CN12.64)
PE1: STM32_microcontroller_IOs (U8.141), ARDUINO_extension_connectors (CN11.61)
PE2: STM32_microcontroller_IOs (U8.1), ARDUINO_extension_connectors (CN9.14 CN11.46)
PE3: STM32_microcontroller_IOs (U8.2), ARDUINO_extension_connectors (CN9.22 CN11.47)
PE4: STM32_microcontroller_IOs (U8.3), ARDUINO_extension_connectors (CN9.16 CN11.48)
PE5: STM32_microcontroller_IOs (U8.4), ARDUINO_extension_connectors (CN9.18 CN11.50)
PE6: STM32_microcontroller_IOs (U8.5), ARDUINO_extension_connectors (CN9.20 CN11.62)
PE7: STM32_microcontroller_IOs (U8.55), ARDUINO_extension_connectors (CN10.20 CN12.44)
PE8: STM32_microcontroller_IOs (U8.56), ARDUINO_extension_connectors (CN10.18 CN12.40)
PE9: STM32_microcontroller_IOs (U8.57), ARDUINO_extension_connectors (CN10.4 CN12.52)
PE10: STM32_microcontroller_IOs (U8.60), ARDUINO_extension_connectors (CN10.24 CN12.47)
PE11: STM32_microcontroller_IOs (U8.61), ARDUINO_extension_connectors (CN10.6 CN12.56)
PE12: STM32_microcontroller_IOs (U8.62), ARDUINO_extension_connectors (CN12.49 SB163.1 SB164.2)
PE13: STM32_microcontroller_IOs (U8.63), ARDUINO_extension_connectors (CN10.10 CN12.55)
PE14: STM32_microcontroller_IOs (U8.64), ARDUINO_extension_connectors (CN12.51 SB165.1 SB166.2)
PE15: STM32_microcontroller_IOs (U8.65), ARDUINO_extension_connectors (CN12.53 SB158.1 SB159.2)
PF0: STM32_microcontroller_IOs (U8.10), ARDUINO_extension_connectors (CN9.21 CN11.53)
PF1: STM32_microcontroller_IOs (U8.11), ARDUINO_extension_connectors (CN9.19 CN11.51)
PF2: STM32_microcontroller_IOs (U8.12), ARDUINO_extension_connectors (CN9.17 CN11.52)
PF3: STM32_microcontroller_IOs (U8.13), ARDUINO_extension_connectors (CN8.14 CN12.58)
PF4: STM32_microcontroller_IOs (U8.14), ARDUINO_extension_connectors (CN12.38)
PF5: STM32_microcontroller_IOs (U8.15), ARDUINO_extension_connectors (CN8.16 CN12.36)
PF6: STM32_microcontroller_IOs (U8.18), ARDUINO_extension_connectors (CN11.9)
PF7: STM32_microcontroller_IOs (U8.19), ARDUINO_extension_connectors (CN9.26 CN11.11)
PF8: STM32_microcontroller_IOs (U8.20), ARDUINO_extension_connectors (CN9.24 CN11.54)
PF9: STM32_microcontroller_IOs (U8.21), ARDUINO_extension_connectors (CN9.28 CN11.56)
PF10: STM32_microcontroller_IOs (U8.22), ARDUINO_extension_connectors (CN12.42)
PF11: STM32_microcontroller_IOs (U8.46), ARDUINO_extension_connectors (CN12.62)
PF12: STM32_microcontroller_IOs (U8.47), ARDUINO_extension_connectors (CN7.20 CN12.59)
PF13: STM32_microcontroller_IOs (U8.50), ARDUINO_extension_connectors (CN10.2 CN12.57)
PF14: STM32_microcontroller_IOs (U8.51), ARDUINO_extension_connectors (CN10.8 CN12.50)
PF15: STM32_microcontroller_IOs (U8.52), ARDUINO_extension_connectors (CN10.12 CN12.60)
PG0: STM32_microcontroller_IOs (U8.53), ARDUINO_extension_connectors (CN9.29 CN11.59)
PG1: STM32_microcontroller_IOs (U8.54), ARDUINO_extension_connectors (CN9.30 CN11.58)
PG2: STM32_microcontroller_IOs (U8.87), ARDUINO_extension_connectors (CN11.42)
PG3: STM32_microcontroller_IOs (U8.88), ARDUINO_extension_connectors (CN11.44)
PG4: STM32_microcontroller_IOs (U8.89), ARDUINO_extension_connectors (CN12.69)
PG5: STM32_microcontroller_IOs (U8.90), ARDUINO_extension_connectors (CN12.68)
PG6: STM32_microcontroller_IOs (U8.91), ARDUINO_extension_connectors (CN12.70)
PG7: STM32_microcontroller_IOs (SB127.2 SB128.2 U8.92), ARDUINO_extension_connectors (SB168.1)
PG8: STM32_microcontroller_IOs (SB129.2 SB130.2 U8.93), ARDUINO_extension_connectors (SB167.2)
PG9: STM32_microcontroller_IOs (U8.124), ARDUINO_extension_connectors (CN11.63)
PG10: STM32_microcontroller_IOs (U8.125), ARDUINO_extension_connectors (CN11.66)
PG12: STM32_microcontroller_IOs (U8.126), ARDUINO_extension_connectors (CN11.65)
PG13: STM32_microcontroller_IOs (U8.127), ARDUINO_extension_connectors (CN11.68)
PG14: STM32_microcontroller_IOs (U8.128), ARDUINO_extension_connectors (CN12.61)
PG15: STM32_microcontroller_IOs (U8.131), ARDUINO_extension_connectors (CN11.64)
PH0: STM32_microcontroller_IOs (SB142.2), ARDUINO_extension_connectors (CN11.29)
PH1: STM32_microcontroller_IOs (SB145.2), ARDUINO_extension_connectors (CN11.31)
PH3-BOOT0: STM32_microcontroller_IOs (R33.1 U8.137), ARDUINO_extension_connectors (CN11.7)
SWO: STM32_microcontroller_IOs (SB140.1), ST_LINK_V2-1 (SB108.2 U100.6)
T_VCP_RX: STM32_microcontroller_IOs (SB126.2 SB129.1), ST_LINK_V2-1 (CN6.1 U2.12)
T_VCP_TX: STM32_microcontroller_IOs (SB124.2 SB127.1), ST_LINK_V2-1 (CN6.2 U2.13)
USB_FS_N: STM32_microcontroller_IOs (SB137.2 U8.103), USB_Type_C (CN15.A7 CN15.B7 U9.1 U9.6)
USB_FS_P: STM32_microcontroller_IOs (SB138.2 U8.104), USB_Type_C (CN15.A6 CN15.B6 U9.3 U9.4)
VBUS_SENSE: STM32_microcontroller_IOs (SB8.2), USB_Type_C (C38.2 R36.2 R37.1)

## Assembly variants
L552ZEQ: not fitted C8 C27 C34 C35 C115 CN11 CN12 HW1 HW11 JP2 R1 R2 R19 R24 R32 R100 R101 R103 SB1 SB6 SB7 SB10 SB11 SB12 SB100 SB102 SB104 SB106 SB108 SB110 SB111 SB113 SB115 SB116 SB117 SB120 SB124 SB126 SB128 SB130 SB143 SB147 SB148 SB149 SB155 U101 X3
L552ZEQ-SOCKET: not fitted C8 C27 C34 C35 C115 CN11 CN12 HW1 JP2 R1 R2 R19 R24 R32 R100 R101 R103 SB1 SB6 SB7 SB10 SB11 SB12 SB100 SB102 SB104 SB106 SB108 SB110 SB111 SB113 SB115 SB116 SB117 SB120 SB124 SB126 SB128 SB130 SB143 SB147 SB148 SB149 SB155 U101 X3; alternate parts C36 -> MCD-01598, C37 -> MCD-01598